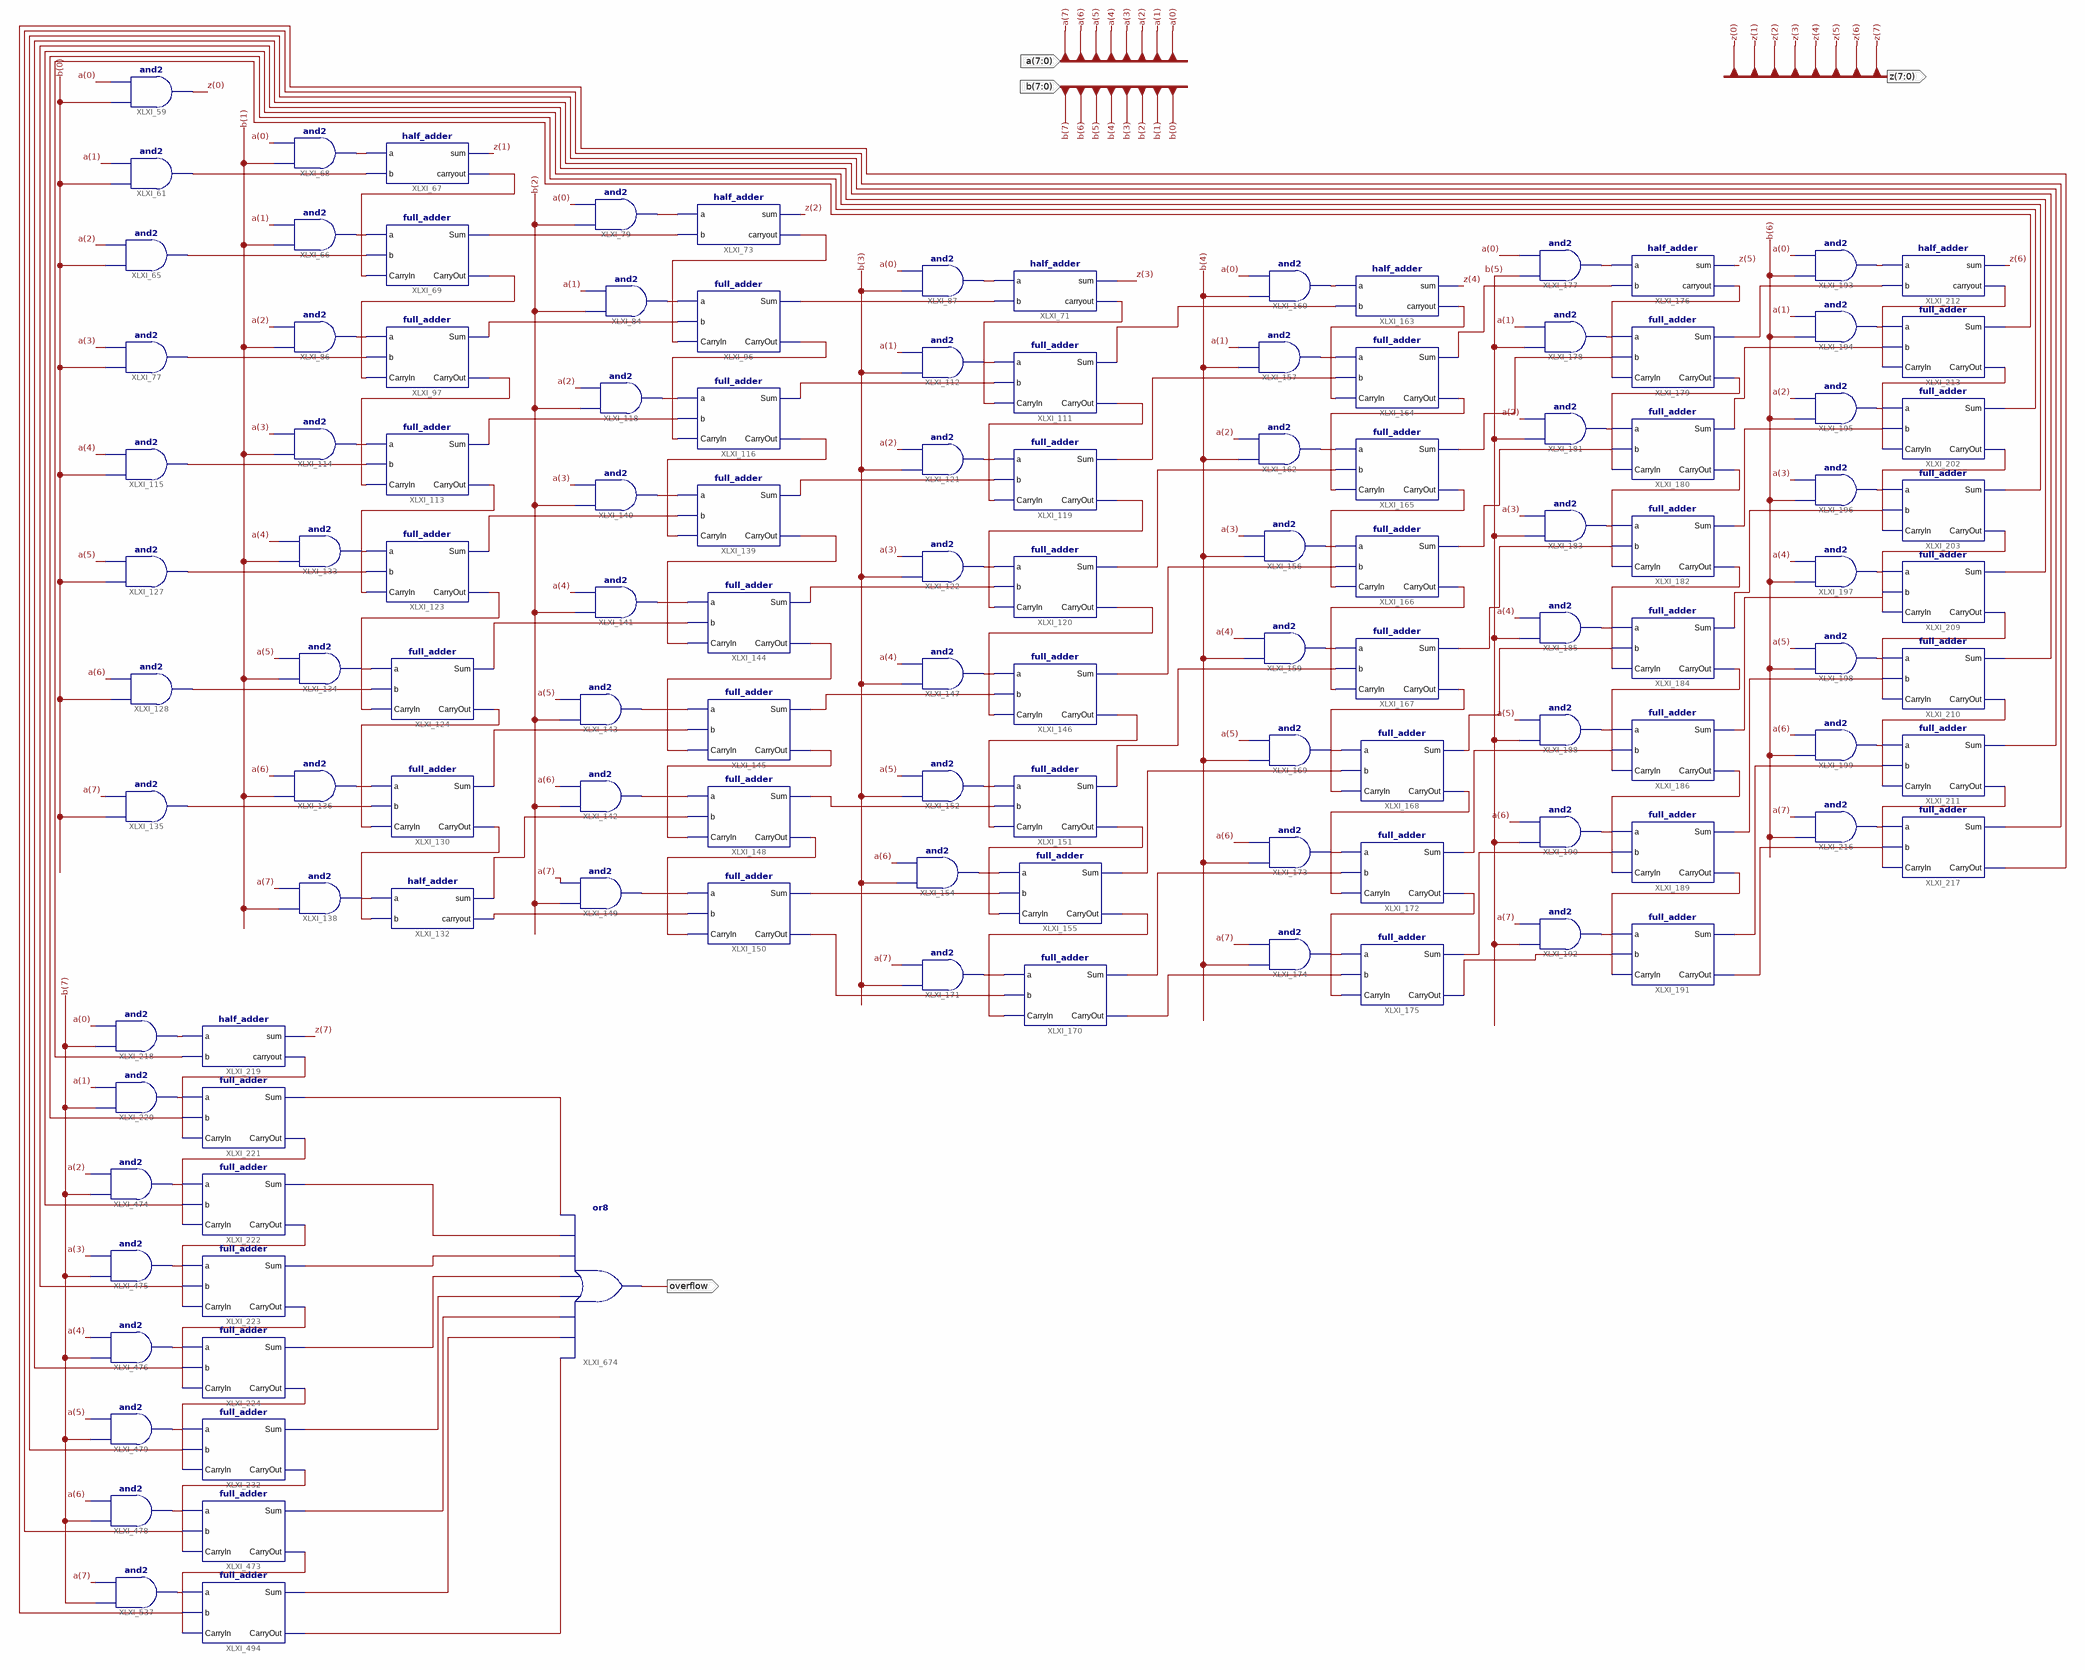
[diagram p0: schematic sheet 1]
// Xilinx ISE schematic eight_bit_multiplier.sch (spartan6) as structural Verilog: 121 symbols, 4 ports
module eight_bit_multiplier (
  input  [7:0] b,
  input  [7:0] a,
  output [7:0] z,
  output overflow
);

  wire XLXN_99, XLXN_103, XLXN_114, XLXN_116, XLXN_118, XLXN_123, XLXN_132, XLXN_142, XLXN_144, XLXN_148,
       XLXN_150, XLXN_151, XLXN_155, XLXN_167, XLXN_174, XLXN_175, XLXN_178, XLXN_180, XLXN_182, XLXN_187,
       XLXN_188, XLXN_189, XLXN_190, XLXN_196, XLXN_200, XLXN_201, XLXN_211, XLXN_212, XLXN_214, XLXN_215,
       XLXN_217, XLXN_218, XLXN_221, XLXN_224, XLXN_226, XLXN_233, XLXN_235, XLXN_236, XLXN_237, XLXN_239,
       XLXN_241, XLXN_242, XLXN_243, XLXN_245, XLXN_246, XLXN_247, XLXN_248, XLXN_249, XLXN_250, XLXN_251,
       XLXN_253, XLXN_260, XLXN_261, XLXN_263, XLXN_264, XLXN_266, XLXN_268, XLXN_269, XLXN_270, XLXN_271,
       XLXN_272, XLXN_276, XLXN_280, XLXN_281, XLXN_286, XLXN_298, XLXN_304, XLXN_308, XLXN_313, XLXN_320,
       XLXN_331, XLXN_334, XLXN_336, XLXN_337, XLXN_341, XLXN_344, XLXN_349, XLXN_354, XLXN_358, XLXN_366,
       XLXN_372, XLXN_376, XLXN_380, XLXN_389, XLXN_390, XLXN_391, XLXN_392, XLXN_393, XLXN_394, XLXN_395,
       XLXN_396, XLXN_397, XLXN_399, XLXN_400, XLXN_401, XLXN_402, XLXN_403, XLXN_404, XLXN_405, XLXN_406,
       XLXN_407, XLXN_408, XLXN_409, XLXN_410, XLXN_412, XLXN_413, XLXN_414, XLXN_416, XLXN_418, XLXN_419,
       XLXN_420, XLXN_421, XLXN_422, XLXN_423, XLXN_424, XLXN_426, XLXN_428, XLXN_429, XLXN_430, XLXN_431,
       XLXN_434, XLXN_435, XLXN_436, XLXN_438, XLXN_439, XLXN_440, XLXN_441, XLXN_442, XLXN_448, XLXN_450,
       XLXN_451, XLXN_452, XLXN_453, XLXN_454, XLXN_455, XLXN_456, XLXN_457, XLXN_462, XLXN_467, XLXN_1031,
       XLXN_1032, XLXN_1033, XLXN_1034, XLXN_1035, XLXN_1107, XLXN_1444, XLXN_1448, XLXN_1449, XLXN_1450,
       XLXN_1451, XLXN_1452, XLXN_1458, XLXN_1460, XLXN_1461, XLXN_1469, XLXN_1470, XLXN_1471, XLXN_1472,
       XLXN_1476, XLXN_1477, XLXN_1478, XLXN_1479, XLXN_1480, XLXN_1481, XLXN_1482, XLXN_1483, XLXN_1484,
       XLXN_1485;

  half_adder XLXI_67 (.a(XLXN_103), .b(XLXN_99), .sum(z[1]), .carryout(XLXN_118));
  and XLXI_68 (XLXN_103, b[1], a[0]);
  and XLXI_61 (XLXN_99, b[0], a[1]);
  full_adder XLXI_69 (.a(XLXN_114), .b(XLXN_116), .CarryIn(XLXN_118), .Sum(XLXN_132), .CarryOut(XLXN_174));
  and XLXI_66 (XLXN_114, b[1], a[1]);
  and XLXI_79 (XLXN_123, b[2], a[0]);
  and XLXI_86 (XLXN_142, b[1], a[2]);
  full_adder XLXI_96 (.a(XLXN_148), .b(XLXN_150), .CarryIn(XLXN_151), .Sum(XLXN_167), .CarryOut(XLXN_189));
  and XLXI_84 (XLXN_148, b[2], a[1]);
  and XLXI_87 (XLXN_155, b[3], a[0]);
  half_adder XLXI_71 (.a(XLXN_155), .b(XLXN_167), .sum(z[3]), .carryout(XLXN_196));
  full_adder XLXI_97 (.a(XLXN_142), .b(XLXN_144), .CarryIn(XLXN_174), .Sum(XLXN_150), .CarryOut(XLXN_182));
  full_adder XLXI_111 (.a(XLXN_175), .b(XLXN_187), .CarryIn(XLXN_196), .Sum(XLXN_389), .CarryOut(XLXN_249));
  and XLXI_112 (XLXN_175, b[3], a[1]);
  full_adder XLXI_113 (.a(XLXN_178), .b(XLXN_180), .CarryIn(XLXN_182), .Sum(XLXN_190), .CarryOut(XLXN_214));
  and XLXI_114 (XLXN_178, b[1], a[3]);
  and XLXI_65 (XLXN_116, b[0], a[2]);
  and XLXI_77 (XLXN_144, b[0], a[3]);
  and XLXI_115 (XLXN_180, b[0], a[4]);
  full_adder XLXI_116 (.a(XLXN_188), .b(XLXN_190), .CarryIn(XLXN_189), .Sum(XLXN_187), .CarryOut(XLXN_239));
  and XLXI_59 (z[0], b[0], a[0]);
  full_adder XLXI_119 (.a(XLXN_200), .b(XLXN_248), .CarryIn(XLXN_249), .Sum(XLXN_390), .CarryOut(XLXN_251));
  full_adder XLXI_120 (.a(XLXN_201), .b(XLXN_250), .CarryIn(XLXN_251), .Sum(XLXN_391), .CarryOut(XLXN_261));
  and XLXI_121 (XLXN_200, b[3], a[2]);
  and XLXI_122 (XLXN_201, b[3], a[3]);
  full_adder XLXI_124 (.a(XLXN_215), .b(XLXN_217), .CarryIn(XLXN_218), .Sum(XLXN_242), .CarryOut(XLXN_226));
  half_adder XLXI_132 (.a(XLXN_233), .b(XLXN_235), .sum(XLXN_264), .carryout(XLXN_269));
  full_adder XLXI_130 (.a(XLXN_224), .b(XLXN_221), .CarryIn(XLXN_226), .Sum(XLXN_246), .CarryOut(XLXN_235));
  and XLXI_127 (XLXN_211, b[0], a[5]);
  and XLXI_133 (XLXN_212, b[1], a[4]);
  full_adder XLXI_123 (.a(XLXN_212), .b(XLXN_211), .CarryIn(XLXN_214), .Sum(XLXN_236), .CarryOut(XLXN_218));
  and XLXI_134 (XLXN_215, b[1], a[5]);
  and XLXI_128 (XLXN_217, b[0], a[6]);
  and XLXI_135 (XLXN_221, b[0], a[7]);
  and XLXI_136 (XLXN_224, b[1], a[6]);
  and XLXI_138 (XLXN_233, b[1], a[7]);
  full_adder XLXI_139 (.a(XLXN_237), .b(XLXN_236), .CarryIn(XLXN_239), .Sum(XLXN_248), .CarryOut(XLXN_243));
  and XLXI_140 (XLXN_237, b[2], a[3]);
  and XLXI_141 (XLXN_241, b[2], a[4]);
  full_adder XLXI_144 (.a(XLXN_241), .b(XLXN_242), .CarryIn(XLXN_243), .Sum(XLXN_250), .CarryOut(XLXN_247));
  and XLXI_143 (XLXN_245, b[2], a[5]);
  full_adder XLXI_145 (.a(XLXN_245), .b(XLXN_246), .CarryIn(XLXN_247), .Sum(XLXN_253), .CarryOut(XLXN_266));
  and XLXI_118 (XLXN_188, b[2], a[2]);
  full_adder XLXI_146 (.a(XLXN_260), .b(XLXN_253), .CarryIn(XLXN_261), .Sum(XLXN_392), .CarryOut(XLXN_331));
  and XLXI_147 (XLXN_260, b[3], a[4]);
  half_adder XLXI_73 (.a(XLXN_123), .b(XLXN_132), .sum(z[2]), .carryout(XLXN_151));
  and XLXI_142 (XLXN_263, b[2], a[6]);
  full_adder XLXI_148 (.a(XLXN_263), .b(XLXN_264), .CarryIn(XLXN_266), .Sum(XLXN_272), .CarryOut(XLXN_270));
  and XLXI_152 (XLXN_271, b[3], a[5]);
  full_adder XLXI_155 (.a(XLXN_276), .b(XLXN_280), .CarryIn(XLXN_281), .Sum(XLXN_394), .CarryOut(XLXN_337));
  and XLXI_154 (XLXN_276, b[3], a[6]);
  full_adder XLXI_150 (.a(XLXN_268), .b(XLXN_269), .CarryIn(XLXN_270), .Sum(XLXN_280), .CarryOut(XLXN_336));
  and XLXI_149 (XLXN_268, b[2], a[7]);
  and XLXI_160 (XLXN_286, b[4], a[0]);
  half_adder XLXI_163 (.a(XLXN_286), .b(XLXN_389), .sum(z[4]), .carryout(XLXN_397));
  and XLXI_157 (XLXN_298, b[4], a[1]);
  full_adder XLXI_164 (.a(XLXN_298), .b(XLXN_390), .CarryIn(XLXN_397), .Sum(XLXN_399), .CarryOut(XLXN_401));
  and XLXI_162 (XLXN_304, b[4], a[2]);
  and XLXI_156 (XLXN_308, b[4], a[3]);
  full_adder XLXI_166 (.a(XLXN_308), .b(XLXN_392), .CarryIn(XLXN_402), .Sum(XLXN_403), .CarryOut(XLXN_404));
  full_adder XLXI_167 (.a(XLXN_313), .b(XLXN_393), .CarryIn(XLXN_404), .Sum(XLXN_406), .CarryOut(XLXN_407));
  and XLXI_159 (XLXN_313, b[4], a[4]);
  full_adder XLXI_168 (.a(XLXN_320), .b(XLXN_394), .CarryIn(XLXN_407), .Sum(XLXN_408), .CarryOut(XLXN_409));
  and XLXI_169 (XLXN_320, b[4], a[5]);
  full_adder XLXI_151 (.a(XLXN_271), .b(XLXN_272), .CarryIn(XLXN_331), .Sum(XLXN_393), .CarryOut(XLXN_281));
  full_adder XLXI_170 (.a(XLXN_334), .b(XLXN_336), .CarryIn(XLXN_337), .Sum(XLXN_395), .CarryOut(XLXN_396));
  and XLXI_171 (XLXN_334, b[3], a[7]);
  and XLXI_173 (XLXN_341, b[4], a[6]);
  full_adder XLXI_172 (.a(XLXN_341), .b(XLXN_395), .CarryIn(XLXN_409), .Sum(XLXN_410), .CarryOut(XLXN_412));
  and XLXI_174 (XLXN_344, b[4], a[7]);
  full_adder XLXI_175 (.a(XLXN_344), .b(XLXN_396), .CarryIn(XLXN_412), .Sum(XLXN_413), .CarryOut(XLXN_414));
  and XLXI_177 (XLXN_349, b[5], a[0]);
  and XLXI_178 (XLXN_354, b[5], a[1]);
  and XLXI_181 (XLXN_358, b[5], a[2]);
  and XLXI_183 (XLXN_405, b[5], a[3]);
  and XLXI_185 (XLXN_366, b[5], a[4]);
  and XLXI_188 (XLXN_372, b[5], a[5]);
  and XLXI_190 (XLXN_376, b[5], a[6]);
  and XLXI_192 (XLXN_380, b[5], a[7]);
  full_adder XLXI_165 (.a(XLXN_304), .b(XLXN_391), .CarryIn(XLXN_401), .Sum(XLXN_400), .CarryOut(XLXN_402));
  full_adder XLXI_182 (.a(XLXN_405), .b(XLXN_406), .CarryIn(XLXN_419), .Sum(XLXN_434), .CarryOut(XLXN_420));
  full_adder XLXI_191 (.a(XLXN_380), .b(XLXN_414), .CarryIn(XLXN_423), .Sum(XLXN_452), .CarryOut(XLXN_453));
  full_adder XLXI_189 (.a(XLXN_376), .b(XLXN_413), .CarryIn(XLXN_422), .Sum(XLXN_451), .CarryOut(XLXN_423));
  full_adder XLXI_186 (.a(XLXN_372), .b(XLXN_410), .CarryIn(XLXN_421), .Sum(XLXN_450), .CarryOut(XLXN_422));
  full_adder XLXI_184 (.a(XLXN_366), .b(XLXN_408), .CarryIn(XLXN_420), .Sum(XLXN_438), .CarryOut(XLXN_421));
  full_adder XLXI_180 (.a(XLXN_358), .b(XLXN_403), .CarryIn(XLXN_418), .Sum(XLXN_429), .CarryOut(XLXN_419));
  full_adder XLXI_179 (.a(XLXN_354), .b(XLXN_400), .CarryIn(XLXN_416), .Sum(XLXN_426), .CarryOut(XLXN_418));
  half_adder XLXI_176 (.a(XLXN_349), .b(XLXN_399), .sum(z[5]), .carryout(XLXN_416));
  and XLXI_193 (XLXN_424, b[6], a[0]);
  half_adder XLXI_212 (.a(XLXN_424), .b(XLXN_426), .sum(z[6]), .carryout(XLXN_430));
  and XLXI_194 (XLXN_428, b[6], a[1]);
  full_adder XLXI_213 (.a(XLXN_428), .b(XLXN_429), .CarryIn(XLXN_430), .Sum(XLXN_1444), .CarryOut(XLXN_435));
  full_adder XLXI_202 (.a(XLXN_431), .b(XLXN_434), .CarryIn(XLXN_435), .Sum(XLXN_1448), .CarryOut(XLXN_439));
  and XLXI_195 (XLXN_431, b[6], a[2]);
  full_adder XLXI_203 (.a(XLXN_436), .b(XLXN_438), .CarryIn(XLXN_439), .Sum(XLXN_1450), .CarryOut(XLXN_454));
  and XLXI_196 (XLXN_436, b[6], a[3]);
  full_adder XLXI_209 (.a(XLXN_440), .b(XLXN_450), .CarryIn(XLXN_454), .Sum(XLXN_1452), .CarryOut(XLXN_455));
  full_adder XLXI_210 (.a(XLXN_441), .b(XLXN_451), .CarryIn(XLXN_455), .Sum(XLXN_1458), .CarryOut(XLXN_456));
  full_adder XLXI_211 (.a(XLXN_442), .b(XLXN_452), .CarryIn(XLXN_456), .Sum(XLXN_1460), .CarryOut(XLXN_457));
  and XLXI_197 (XLXN_440, b[6], a[4]);
  and XLXI_198 (XLXN_441, b[6], a[5]);
  and XLXI_199 (XLXN_442, b[6], a[6]);
  full_adder XLXI_217 (.a(XLXN_448), .b(XLXN_453), .CarryIn(XLXN_457), .Sum(XLXN_1461), .CarryOut(XLXN_1469));
  and XLXI_216 (XLXN_448, b[6], a[7]);
  half_adder XLXI_219 (.a(XLXN_462), .b(XLXN_1444), .sum(z[7]), .carryout(XLXN_1449));
  and XLXI_218 (XLXN_462, b[7], a[0]);
  full_adder XLXI_221 (.a(XLXN_467), .b(XLXN_1448), .CarryIn(XLXN_1449), .Sum(XLXN_1478), .CarryOut(XLXN_1451));
  and XLXI_220 (XLXN_467, b[7], a[1]);
  full_adder XLXI_222 (.a(XLXN_1031), .b(XLXN_1450), .CarryIn(XLXN_1451), .Sum(XLXN_1479), .CarryOut(XLXN_1470));
  full_adder XLXI_223 (.a(XLXN_1032), .b(XLXN_1452), .CarryIn(XLXN_1470), .Sum(XLXN_1480), .CarryOut(XLXN_1471));
  full_adder XLXI_224 (.a(XLXN_1033), .b(XLXN_1458), .CarryIn(XLXN_1471), .Sum(XLXN_1481), .CarryOut(XLXN_1472));
  full_adder XLXI_232 (.a(XLXN_1035), .b(XLXN_1460), .CarryIn(XLXN_1472), .Sum(XLXN_1482), .CarryOut(XLXN_1476));
  full_adder XLXI_473 (.a(XLXN_1034), .b(XLXN_1461), .CarryIn(XLXN_1476), .Sum(XLXN_1483), .CarryOut(XLXN_1477));
  and XLXI_474 (XLXN_1031, b[7], a[2]);
  and XLXI_475 (XLXN_1032, b[7], a[3]);
  and XLXI_476 (XLXN_1033, b[7], a[4]);
  and XLXI_478 (XLXN_1034, b[7], a[6]);
  and XLXI_479 (XLXN_1035, b[7], a[5]);
  full_adder XLXI_494 (.a(XLXN_1107), .b(XLXN_1469), .CarryIn(XLXN_1477), .Sum(XLXN_1484), .CarryOut(XLXN_1485));
  and XLXI_537 (XLXN_1107, b[7], a[7]);
  or XLXI_674 (overflow, XLXN_1485, XLXN_1484, XLXN_1483, XLXN_1482, XLXN_1481, XLXN_1480, XLXN_1479, XLXN_1478);
endmodule
